# Altium schematic sheet processor.SchDoc
size A4
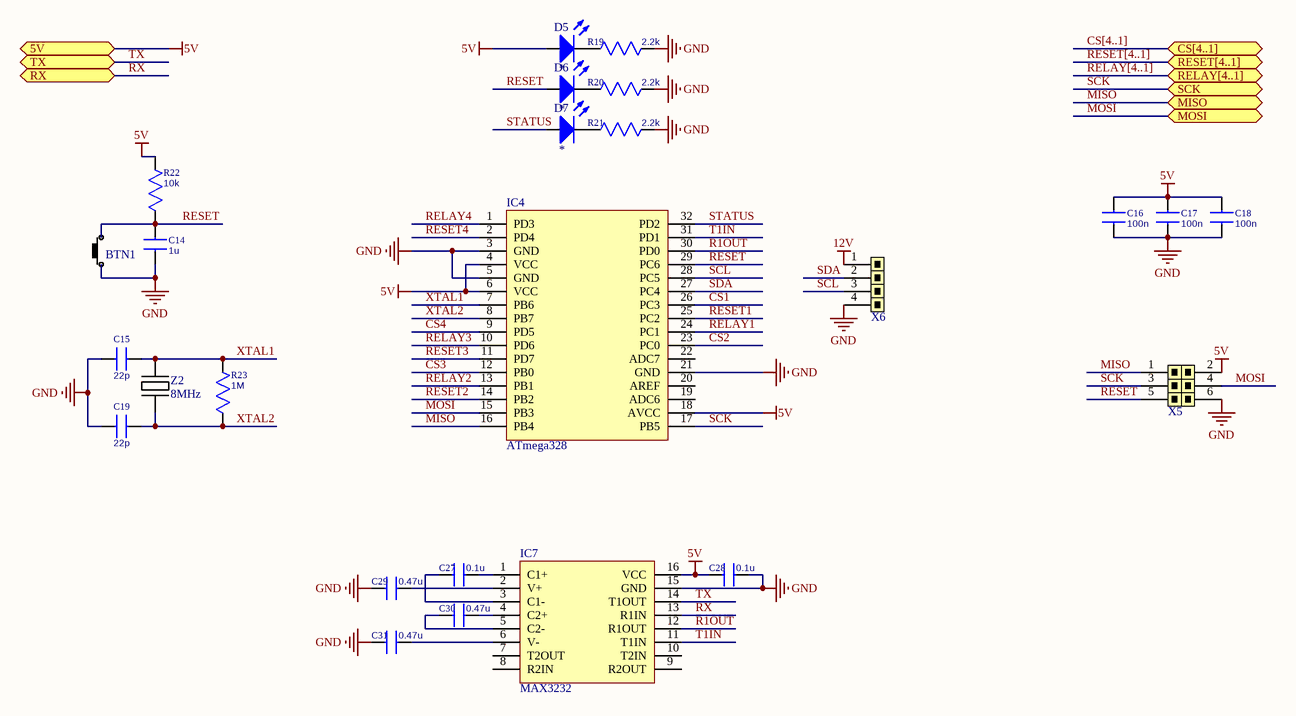
[diagram p0: processor.SchDoc]

## Parts
BTN1  Push Button  [PUSH BUTTON]  (value not drawn)
C14  1u  [C_0603]
C15  22p  [C_0603]
C16  100n  [C_0603]
C17  100n  [C_0603]
C18  100n  [C_0603]
C19  22p  [C_0603]
C27  0.1u  [C_0805]
C28  0.1u  [C_0805]
C29  0.47u  [C_0805]
C30  0.47u  [C_0805]
C31  0.47u  [C_0805]
D5  *  [LED_5mm]
D6  *  [LED_5mm]
D7  *  [LED_5mm]
IC4  ATmega328  [TQFP-32]
IC7  MAX3232  [SSOP-16]
R19  2.2k  [R_0603]
R20  2.2k  [R_0603]
R21  2.2k  [R_0603]
R22  10k  [R_0603]
R23  1M  [R_0603]
X5  PLD-6  [PLD-6]  (value not drawn)
X6  PLS-4  [PLS-4]  (value not drawn)
Z2  8MHz  [HC-49]

## Ports
5V, CS[4..1], MISO, MOSI, RELAY[4..1], RESET[4..1], RX, SCK, TX

## Nets
5V: C16.2 C17.2 C18.2 C28.1 D5.1(A) IC4.4(VCC) IC4.6(VCC) IC4.18(AVCC) IC7.16(VCC) R22.1 X5.2 ; port 5V
12V: X6.1
GND: BTN1.1 C14.1 C15.2 C16.1 C17.1 C18.1 C19.2 C28.2 C29.1 C31.1 IC4.3(GND) IC4.5(GND) IC4.21(GND) IC7.15(GND) R19.2 R20.2 R21.2 X5.6 X6.4
CS1: IC4.26(PC3)
CS2: IC4.23(PC0)
CS3: IC4.12(PB0)
CS4: IC4.9(PD5)
MISO: IC4.16(PB4) X5.1 ; port MISO
MOSI: IC4.15(PB3) X5.4 ; port MOSI
R1OUT: IC4.30(PD0) IC7.12(R1OUT)
RELAY1: IC4.24(PC1)
RELAY2: IC4.13(PB1)
RELAY3: IC4.10(PD6)
RELAY4: IC4.1(PD3)
RESET: BTN1.2 C14.2 D6.1(A) IC4.29(PC6) R22.2 X5.5
RESET1: IC4.25(PC2)
RESET2: IC4.14(PB2)
RESET3: IC4.11(PD7)
RESET4: IC4.2(PD4)
RX: IC7.13(R1IN) ; port RX
SCK: IC4.17(PB5) X5.3 ; port SCK
SCL: IC4.28(PC5) X6.3
SDA: IC4.27(PC4) X6.2
STATUS: D7.1(A) IC4.32(PD2)
T1IN: IC4.31(PD1) IC7.11(T1IN)
TX: IC7.14(T1OUT) ; port TX
XTAL1: C15.1 IC4.7(PB6) R23.1 Z2.2
XTAL2: C19.1 IC4.8(PB7) R23.2 Z2.1
NetC27_1: C27.1 IC7.3(C1-)
NetC27_2: C27.2 IC7.1(C1+)
NetC29_2: C29.2 IC7.2(V+)
NetC30_1: C30.1 IC7.5(C2-)
NetC30_2: C30.2 IC7.4(C2+)
NetC31_2: C31.2 IC7.6(V-)
NetD5_2: D5.2(K) R19.1
NetD6_2: D6.2(K) R20.1
NetD7_2: D7.2(K) R21.1

Not connected (* = marked no-connect by the designer): IC4 19(ADC6) 20(AREF) 22(ADC7); IC7 7(T2OUT) 8(R2IN) 9(R2OUT) 10(T2IN)

## Buses and harness runs
bus CS[4..1] = port CS[4..1]
bus RELAY[4..1] = port RELAY[4..1]
bus RESET[4..1] = port RESET[4..1]

## Library data of the parts
C14-C19 = C0603: Capacitor
  C14: Value: 1u
  C15 C19: Value: 22p
  C16-C18: Value: 100n
C27-C31 = C0805: Capacitor
  C27 C28: Value: 0.1u
  C29-C31: Value: 0.47u
D5-D7 = LED_5mm: Typical INFRARED GaAs LED; Value: *; Color: *
IC4 = ATmega328: High Performance, Low Power Atmel AVR 8-Bit Microcontroller
IC7 = MAX3232: RS-232 Line Driver/Receiver With ±15-kV ESD Protection
R19-R23 = R0603: Resistor
  R19-R21: Value: 2.2k
  R22: Value: 10k
  R23: Value: 1M
Z2 = XTAL: Quartz resonator